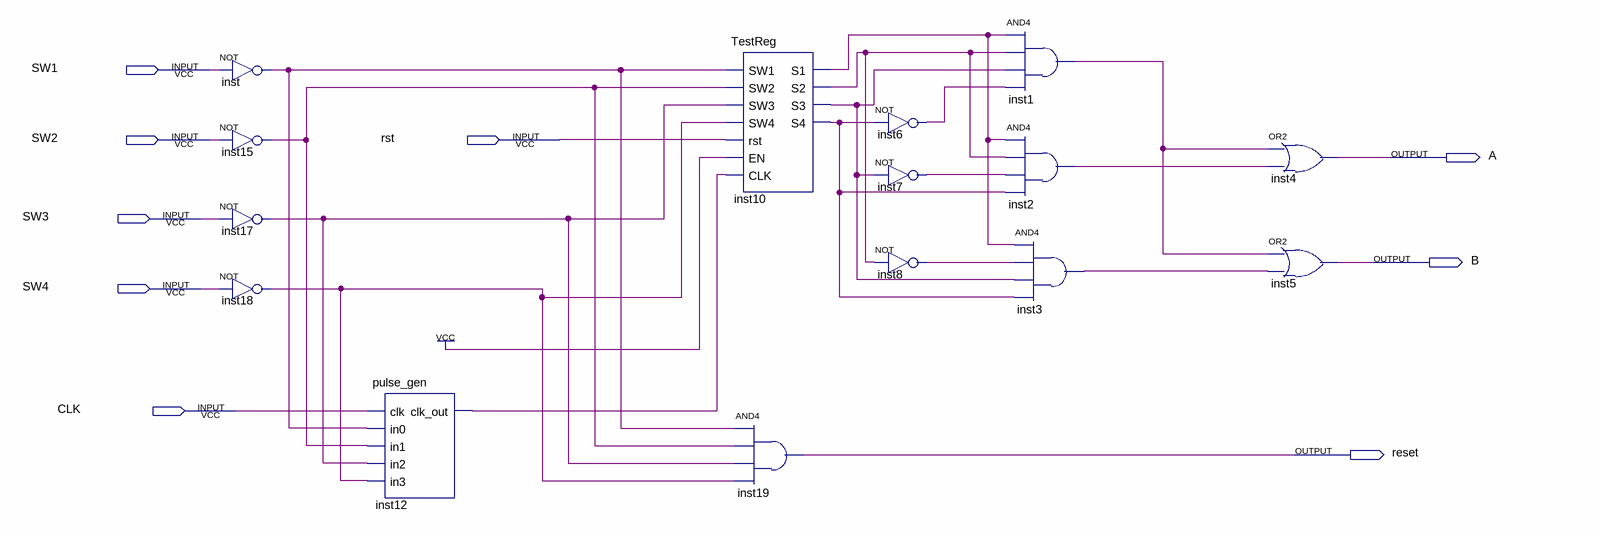
[diagram p0: schematic sheet]
// Quartus schematic SeqDet.bdf as structural Verilog: 15 symbols, 9 pins
module SeqDet (
  input  SW1,
  input  SW2,
  input  rst,
  input  SW3,
  input  SW4,
  input  CLK,
  output A,
  output B,
  output reset
);

  wire inst1_out, inst2_out, inst3_out, inst6_out, inst7_out, inst8_out, inst10_s1, inst10_s2, inst10_s3,
       inst10_s4, inst12_clk_out, inst15_out, inst17_out, inst18_out, inst_out;

  not inst (inst_out, SW1);
  not inst15 (inst15_out, SW2);
  not inst17 (inst17_out, SW3);
  not inst18 (inst18_out, SW4);
  pulse_gen inst12 (
    .clk(CLK), .in0(inst_out), .in1(inst15_out), .in2(inst17_out), .in3(inst18_out), .clk_out(inst12_clk_out));
  TestReg inst10 (
    .SW1(inst_out), .SW2(inst15_out), .SW3(inst17_out), .SW4(inst18_out), .rst(rst), .EN(1'b1),
    .CLK(inst12_clk_out), .S1(inst10_s1), .S2(inst10_s2), .S3(inst10_s3), .S4(inst10_s4));
  and inst19 (reset, inst_out, inst15_out, inst17_out, inst18_out);
  not inst6 (inst6_out, inst10_s4);
  not inst7 (inst7_out, inst10_s3);
  not inst8 (inst8_out, inst10_s2);
  and inst1 (inst1_out, inst10_s1, inst10_s2, inst10_s3, inst6_out);
  and inst2 (inst2_out, inst10_s1, inst10_s2, inst7_out, inst10_s4);
  and inst3 (inst3_out, inst10_s1, inst8_out, inst10_s3, inst10_s4);
  or inst4 (A, inst1_out, inst2_out);
  or inst5 (B, inst1_out, inst3_out);
endmodule
